# Altium project TPC.PrjPcb
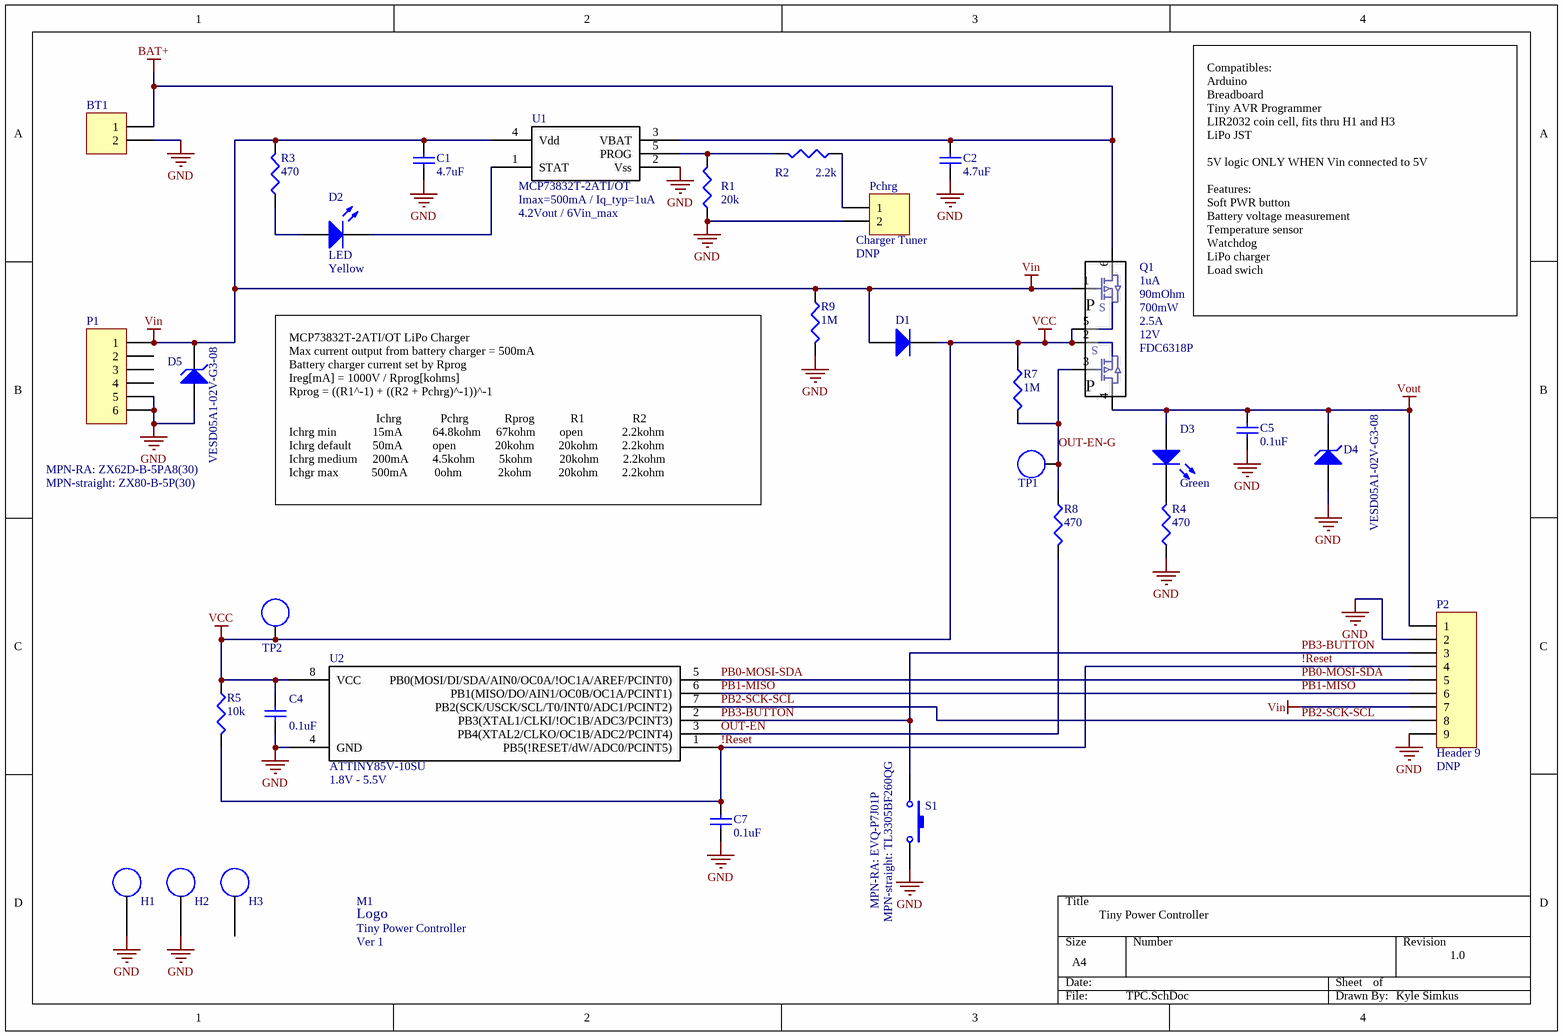
[diagram p0: TPC.SchDoc]
1 sheet, 32 parts. Net scope: global (net labels, ports and power ports of the same name join across sheets).

## Sheet TPC.SchDoc
size A4; DrawnBy: Kasper

### Parts
BT1  JST connector  [JST-DUAL-Batt - 2mm 3_5mm]  (value not drawn)
C1  value 4.7uF  [C0603]  (hidden comment: CAP)
C2  value 4.7uF  [C0603]  (hidden comment: CAP)
C4  value 0.1uF  [C0603]  (hidden comment: CAP)
C5  value 0.1uF  [C0603]  (hidden comment: CAP)
C7  value 0.1uF  [C0603]  (hidden comment: CAP)
D1  Diode  [SOD128]  (value not drawn)
D2  LED  value Yellow  [0805 [2012] LED]
D3  value Green  [0805 [2012] LED]  (hidden comment: LED)
D4  MPN: VESD05A1-02V-G3-08  [SOD523]  (hidden comment: DIODE)
D5  MPN: VESD05A1-02V-G3-08  [SOD523]  (hidden comment: DIODE)
H1  MountingHole  [Mounting-Hole-2-56]  (value not drawn)  (no BOM)
H2  MountingHole  [Mounting-Hole-2-56]  (value not drawn)  (no BOM)
H3  MountingHole  [Mounting-Hole-2-56 - isolated]  (value not drawn)  (no BOM)
M1  Ver 1  FullName: Tiny Power Controller  [Logo-KAS]  (no BOM)
P1  MPN-RA: ZX62D-B-5PA8(30)  MPN-straight: ZX80-B-5P(30)  [USBmicro-DUAL Hirose Dual sided]  (hidden comment: USB micro)
P2  Header 9  [HDR1X9]  (no BOM)
Pchrg  Charger Tuner  [HDR1X2]  (no BOM)
Q1  Idss: 1uA  Rds: 90mOhm  Pmax: 700mW  Id: 2.5A  Vdss: 12V  MPN: FDC6318P  [SOT-23-6]  (hidden comment: 2x PMOS)
R1  value 20k  [R0603]  (hidden comment: RES)
R2  value 2.2k  [R0603]  (hidden comment: RES)
R3  value 470  [R0603]  (hidden comment: RES)
R4  value 470  [R0603]  (hidden comment: RES)
R5  value 10k  [R0603]  (hidden comment: RES)
R7  value 1M  [R0603]  (hidden comment: RES)
R8  value 470  [R0603]  (hidden comment: RES)
R9  value 1M  [R0603]  (hidden comment: RES)
S1  MPN-RA: EVQ-P7J01P  MPN-straight: TL3305BF260QG  [SW Multi TH]  (hidden comment: BUTTON)
TP1  TestPoint  [TestPoint-1_0-smt]  (value not drawn)  (no BOM)
TP2  TestPoint  [TestPoint-1_0-smt]  (value not drawn)  (no BOM)
U1  Current: Imax=500mA / Iq_typ=1uA  Voltage: 4.2Vout / 6Vin_max  [SOT-23-5]  (hidden comment: Charger)
U2  Voltage: 1.8V - 5.5V  MPN: ATTINY85V-10SU  [8-SOIC-5.3mm]  (hidden comment: MCU)

### Nets
BAT+: BT1.1 C2.2 Q1.6(D) U1.3(VBAT)
GND: BT1.2 C1.1 C2.1 C4.1 C5.1 C7.1 D4.1(A) D5.1(A) H1.0 H2.0 P1.5 P1.6 P2.2 P2.9 Pchrg.2 R1.1 R4.1 R9.2 S1.1 U1.2(Vss) U2.4(GND)
VCC: C4.2 D1.2(K) Q1.2(S) Q1.5(S) R5.1 R7.1 TP2.0(TestPoint) U2.8(VCC)
Vin: C1.2 D1.1(A) D5.2(K) P1.1 P2.7 Q1.1(G) R3.2 R9.1 U1.4(Vdd)
Vout: C5.2 D3.1(A) D4.2(K) P2.1 Q1.4(D)
!Reset: C7.2 P2.4 R5.2 U2.1(PB5(!RESET/dW/ADC0/PCINT5))
OUT-EN: R8.2 U2.3(PB4(XTAL2/CLKO/OC1B/ADC2/PCINT4))
OUT-EN-G: Q1.3(G) R7.2 R8.1 TP1.0(TestPoint)
PB0-MOSI-SDA: P2.5 U2.5(PB0(MOSI/DI/SDA/AIN0/OC0A/!OC1A/AREF/PCINT0))
PB1-MISO: P2.6 U2.6(PB1(MISO/DO/AIN1/OC0B/OC1A/PCINT1))
PB2-SCK-SCL: P2.8 U2.7(PB2(SCK/USCK/SCL/T0/INT0/ADC1/PCINT2))
PB3-BUTTON: P2.3 S1.2 U2.2(PB3(XTAL1/CLKI/!OC1B/ADC3/PCINT3))
NetD2_1: D2.1(A) R3.1
NetD2_2: D2.2(K) U1.1(STAT)
NetD3_2: D3.2(K) R4.2
NetPchrg_1: Pchrg.1 R2.1
NetR1_2: R1.2 R2.2 U1.5(PROG)

Not connected (* = marked no-connect by the designer): H3 0; P1 2 3 4

### Notes on the sheet
- Compatibles:
  Arduino
  Breadboard
  Tiny AVR Programmer
  LIR2032 coin cell, fits thru H1 and H3
  LiPo JST
  5V logic ONLY WHEN Vin connected to 5V
  Features:
  Soft PWR button
  Battery voltage measurement
  Temperature sensor
  Watchdog
  LiPo charger
  Load swich
- MCP73832T-2ATI/OT LiPo Charger
  Max current output from battery charger = 500mA
  Battery charger current set by Rprog
  Ireg[mA] = 1000V / Rprog[kohms]
  Rprog = ((R1^-1) + ((R2 + Pchrg)^-1))^-1
  Ichrg             Pchrg            Rprog            R1                R2
  Ichrg min            15mA          64.8kohm     67kohm        open             2.2kohm
  Ichrg default       50mA          open             20kohm        20kohm        2.2kohm
  Ichrg medium     200mA        4.5kohm        5kohm         20kohm        2.2kohm
  Ichgr max           500mA         0ohm            2kohm         20kohm        2.2kohm
- Tiny Power Controller
- 1.0
- Kyle Simkus
- (in symbol MOSFET-P-x2) P

### Library data of the parts
BT1 = Header 2: CONN HEADER VERT 2POS 2MM; MPN-seeedSKU: 320170005; MPN: B2B-PH-K-S(LF)(SN); MPN2: S2B-PH-K-S(LF)(SN); JLC-PN: C131337
C1 C2 = Cap Semi: CAP CER 4.7UF 10V X5R 0603; MPN: CL10A475KP8NNNC; Voltage: V; JLC-PN: C1705
C4 C5 C7 = Cap Semi: CAP CER 0.1UF 16V X7R 0603; MPN: CL10B104KO8NNNC; Voltage: V; JLC-PN: C1525
D1 = Diode: DIODE SCHOTTK 60V 3A SOD128/CFP5; MPN: PMEG6030ELPX; Value: 60V 3A; JLC-PN: C2908821
D2 = LED2: LED YELLOW CLEAR 0805 SMD; MPN: QTLP630C3TR; DKPN: 1080-1410-1-ND; JLC-PN: C6958991
D3 = LED2: LED GREEN CLEAR 0805 SMD; MPN: QTLP630C4TR/FC17-21SYGC/S530-E2/TR8; JLC-PN: C6368479
D4 D5 = D Zener: TVS DIODE 5VWM 12VC SOD523; MPNoldTiny: SP1003-01DTG; MPNbig: SD05T1G; JLC-PN: C3703729
M1 = Logo-KAS: Logo; DNP: DNP
P1 = Header 6: CONN RCPT USB2.0 MICRO B SMD R/A; JLC-PN: C132350; MPN: ZX62D-B-5PA8(30)
P2 = Header 9: Header, 9-Pin; DNP: DNP
Pchrg = Header 2: Header, 2-Pin; DNP: DNP
Q1 = MOSFET-P-x2: MOSFET 2P-CH 12V 2.5A SSOT-6; MPN2: DMP2240UDM-7; JLC-PN: C157543
R1 = Res3: RES SMD 20K OHM 1% 1/10W 0603; MPN: ERJ-3EKF2002V; JLC-PN: C403057
R2 = Res3: RES SMD 2.2K OHM 1% 1/10W 0603; MPN: ERJ3EKF2201V; JLC-PN: C116387
R3 R4 R8 = Res3: RES SMD 470 OHM 5% 1/10W 0603; MPN: ERJ-3GEYJ471V; JLC-PN: C169852
R5 = Res3: Resistor; MPN: ERJ-3GEYJ103V; JLC-PN: C169849
R7 R9 = Res3: RES SMD 1M OHM 5% 1/10W 0603; MPN: ERJ-3GEYJ105V; JLC-PN: C278634
S1 = SW-PB: SWITCH TACTILE SPST-NO 0.05A 12V; JLC-PN: C2828254; MPN: EVQ-P7J01P
U1 = MCP73832T-2ATI/OT: LiPo Charger 500mA 4.2V; JLC-PN: C173380; MPN: MCP73832T-2ATI/OT
U2 = ATtiny85-20SU: IC MCU 8BIT 8KB FLASH 8SOIC; JLC-PN: C152192
H1-H3 = MountingHole: DNP: DNP
TP1 TP2 = TestPoint: DNP: DNP